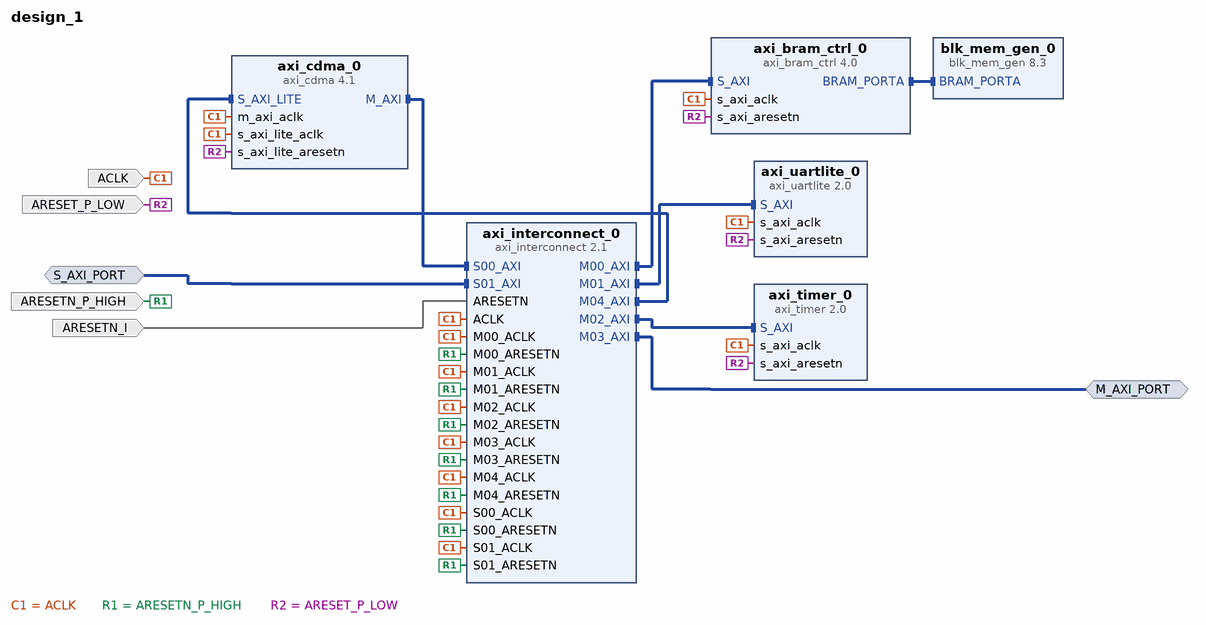
[diagram p0: block diagram of the top level]
# Vivado block design design_1, Vivado 2016.2
create_bd_design design_1

create_bd_intf_port -mode Master -vlnv xilinx.com:interface:aximm_rtl:1.0 M_AXI_PORT
set_property -dict [list \
  CONFIG.DATA_WIDTH 32 \
  CONFIG.PROTOCOL AXI4 \
  CONFIG.FREQ_HZ 10000000 \
  CONFIG.ADDR_WIDTH 32 \
  CONFIG.NUM_READ_OUTSTANDING 2 \
  CONFIG.NUM_WRITE_OUTSTANDING 2 \
] [get_bd_intf_ports M_AXI_PORT]
create_bd_intf_port -mode Slave -vlnv xilinx.com:interface:aximm_rtl:1.0 S_AXI_PORT
set_property -dict [list \
  CONFIG.DATA_WIDTH 32 \
  CONFIG.PROTOCOL AXI4 \
  CONFIG.FREQ_HZ 10000000 \
  CONFIG.ID_WIDTH 1 \
  CONFIG.ADDR_WIDTH 32 \
  CONFIG.AWUSER_WIDTH 0 \
  CONFIG.ARUSER_WIDTH 0 \
  CONFIG.WUSER_WIDTH 0 \
  CONFIG.RUSER_WIDTH 0 \
  CONFIG.BUSER_WIDTH 0 \
  CONFIG.READ_WRITE_MODE READ_WRITE \
  CONFIG.HAS_BURST 1 \
  CONFIG.HAS_LOCK 1 \
  CONFIG.HAS_PROT 1 \
  CONFIG.HAS_CACHE 1 \
  CONFIG.HAS_QOS 1 \
  CONFIG.HAS_REGION 0 \
  CONFIG.HAS_WSTRB 1 \
  CONFIG.HAS_BRESP 1 \
  CONFIG.HAS_RRESP 1 \
  CONFIG.SUPPORTS_NARROW_BURST 1 \
  CONFIG.NUM_READ_OUTSTANDING 2 \
  CONFIG.NUM_WRITE_OUTSTANDING 2 \
  CONFIG.MAX_BURST_LENGTH 256 \
] [get_bd_intf_ports S_AXI_PORT]
create_bd_port -dir I -type clk ACLK
set_property -dict [list \
  CONFIG.FREQ_HZ 10000000 \
  CONFIG.ASSOCIATED_BUSIF S_AXI_PORT:M_AXI_PORT \
  CONFIG.ASSOCIATED_RESET ARESETN_I:ARESETN_P_HIGH:ARESET_P_LOW \
] [get_bd_ports ACLK]
create_bd_port -dir I -type rst ARESETN_I
set_property -dict {CONFIG.POLARITY ACTIVE_LOW} [get_bd_ports ARESETN_I]
create_bd_port -dir I -type rst ARESETN_P_HIGH
set_property -dict {CONFIG.POLARITY ACTIVE_HIGH} [get_bd_ports ARESETN_P_HIGH]
create_bd_port -dir I -type rst ARESET_P_LOW

create_bd_cell -type ip -vlnv xilinx.com:ip:axi_interconnect:2.1 axi_interconnect_0
set_property -dict {CONFIG.NUM_SI 2 CONFIG.NUM_MI 5} [get_bd_cells axi_interconnect_0]
create_bd_cell -type ip -vlnv xilinx.com:ip:axi_timer:2.0 axi_timer_0
create_bd_cell -type ip -vlnv xilinx.com:ip:axi_uartlite:2.0 axi_uartlite_0
create_bd_cell -type ip -vlnv xilinx.com:ip:blk_mem_gen:8.3 blk_mem_gen_0
create_bd_cell -type ip -vlnv xilinx.com:ip:axi_bram_ctrl:4.0 axi_bram_ctrl_0
set_property -dict {CONFIG.SINGLE_PORT_BRAM 1} [get_bd_cells axi_bram_ctrl_0]
create_bd_cell -type ip -vlnv xilinx.com:ip:axi_cdma:4.1 axi_cdma_0
set_property -dict {CONFIG.C_M_AXI_MAX_BURST_LEN 256 CONFIG.C_INCLUDE_SG 0} [get_bd_cells axi_cdma_0]

# ---- connections ----

connect_bd_intf_net [get_bd_intf_pins blk_mem_gen_0/BRAM_PORTA] [get_bd_intf_pins axi_bram_ctrl_0/BRAM_PORTA]
connect_bd_intf_net [get_bd_intf_pins axi_interconnect_0/M00_AXI] [get_bd_intf_pins axi_bram_ctrl_0/S_AXI]
connect_bd_intf_net [get_bd_intf_pins axi_interconnect_0/M01_AXI] [get_bd_intf_pins axi_uartlite_0/S_AXI]
connect_bd_intf_net [get_bd_intf_pins axi_interconnect_0/M02_AXI] [get_bd_intf_pins axi_timer_0/S_AXI]
connect_bd_intf_net [get_bd_intf_pins axi_cdma_0/M_AXI] [get_bd_intf_pins axi_interconnect_0/S00_AXI]
connect_bd_intf_net [get_bd_intf_pins axi_interconnect_0/M04_AXI] [get_bd_intf_pins axi_cdma_0/S_AXI_LITE]
connect_bd_intf_net [get_bd_intf_ports M_AXI_PORT] [get_bd_intf_pins axi_interconnect_0/M03_AXI]
connect_bd_intf_net [get_bd_intf_ports S_AXI_PORT] [get_bd_intf_pins axi_interconnect_0/S01_AXI]
connect_bd_net [get_bd_ports ACLK] \
  [get_bd_pins axi_interconnect_0/ACLK] [get_bd_pins axi_cdma_0/m_axi_aclk] [get_bd_pins axi_cdma_0/s_axi_lite_aclk] \
  [get_bd_pins axi_interconnect_0/S00_ACLK] [get_bd_pins axi_interconnect_0/M00_ACLK] \
  [get_bd_pins axi_interconnect_0/M01_ACLK] [get_bd_pins axi_interconnect_0/M02_ACLK] \
  [get_bd_pins axi_interconnect_0/M03_ACLK] [get_bd_pins axi_interconnect_0/S01_ACLK] \
  [get_bd_pins axi_interconnect_0/M04_ACLK] [get_bd_pins axi_bram_ctrl_0/s_axi_aclk] [get_bd_pins axi_uartlite_0/s_axi_aclk] \
  [get_bd_pins axi_timer_0/s_axi_aclk]
connect_bd_net -net ARESETN_1 [get_bd_ports ARESETN_I] [get_bd_pins axi_interconnect_0/ARESETN]
connect_bd_net [get_bd_ports ARESETN_P_HIGH] \
  [get_bd_pins axi_interconnect_0/S00_ARESETN] [get_bd_pins axi_interconnect_0/M00_ARESETN] \
  [get_bd_pins axi_interconnect_0/M01_ARESETN] [get_bd_pins axi_interconnect_0/M02_ARESETN] \
  [get_bd_pins axi_interconnect_0/M03_ARESETN] [get_bd_pins axi_interconnect_0/S01_ARESETN] \
  [get_bd_pins axi_interconnect_0/M04_ARESETN]
connect_bd_net [get_bd_ports ARESET_P_LOW] \
  [get_bd_pins axi_cdma_0/s_axi_lite_aresetn] [get_bd_pins axi_bram_ctrl_0/s_axi_aresetn] \
  [get_bd_pins axi_uartlite_0/s_axi_aresetn] [get_bd_pins axi_timer_0/s_axi_aresetn]

# ---- address map ----
assign_bd_address -offset 0x40000000 -range 4K -target_address_space [get_bd_addr_spaces axi_cdma_0/Data] [get_bd_addr_segs axi_uartlite_0/S_AXI/Reg]
assign_bd_address -offset 0x40010000 -range 64K -target_address_space [get_bd_addr_spaces axi_cdma_0/Data] [get_bd_addr_segs axi_timer_0/S_AXI/Reg]
assign_bd_address -offset 0x40020000 -range 128K -target_address_space [get_bd_addr_spaces axi_cdma_0/Data] [get_bd_addr_segs axi_bram_ctrl_0/S_AXI/Mem0]
assign_bd_address -offset 0x40040000 -range 64K -target_address_space [get_bd_addr_spaces axi_cdma_0/Data] [get_bd_addr_segs axi_cdma_0/S_AXI_LITE/Reg]
assign_bd_address -offset 0x44A00000 -range 2M -target_address_space [get_bd_addr_spaces axi_cdma_0/Data] [get_bd_addr_segs M_AXI_PORT/Reg]
assign_bd_address -offset 0x40000000 -range 4K -target_address_space [get_bd_addr_spaces S_AXI_PORT] [get_bd_addr_segs axi_uartlite_0/S_AXI/Reg]
assign_bd_address -offset 0x40010000 -range 64K -target_address_space [get_bd_addr_spaces S_AXI_PORT] [get_bd_addr_segs axi_timer_0/S_AXI/Reg]
assign_bd_address -offset 0x40020000 -range 128K -target_address_space [get_bd_addr_spaces S_AXI_PORT] [get_bd_addr_segs axi_bram_ctrl_0/S_AXI/Mem0]
assign_bd_address -offset 0x40040000 -range 64K -target_address_space [get_bd_addr_spaces S_AXI_PORT] [get_bd_addr_segs axi_cdma_0/S_AXI_LITE/Reg]
assign_bd_address -offset 0x44A00000 -range 2M -target_address_space [get_bd_addr_spaces S_AXI_PORT] [get_bd_addr_segs M_AXI_PORT/Reg]

validate_bd_design
save_bd_design
